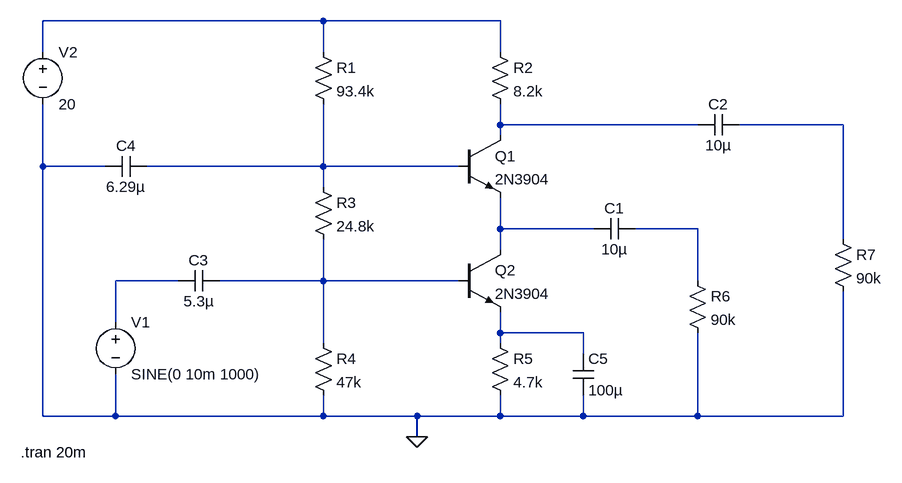
[diagram p0: schematic cascode_amplifier.asc]
cascode_amplifier.asc, the LTspice schematic file:
Version 4
SHEET 1 1124 680
WIRE 256 -16 -176 -16
WIRE 528 -16 256 -16
WIRE -176 32 -176 -16
WIRE 256 32 256 -16
WIRE 528 32 528 -16
WIRE 528 144 528 112
WIRE 832 144 528 144
WIRE 1056 144 896 144
WIRE 528 160 528 144
WIRE -176 208 -176 112
WIRE -80 208 -176 208
WIRE 256 208 256 112
WIRE 256 208 -16 208
WIRE 464 208 256 208
WIRE 256 240 256 208
WIRE 528 304 528 256
WIRE 672 304 528 304
WIRE 832 304 736 304
WIRE 1056 320 1056 144
WIRE 528 336 528 304
WIRE 32 384 -64 384
WIRE 256 384 256 320
WIRE 256 384 96 384
WIRE 464 384 256 384
WIRE 832 384 832 304
WIRE -64 448 -64 384
WIRE 528 464 528 432
WIRE 656 464 528 464
WIRE 256 480 256 384
WIRE 528 480 528 464
WIRE 656 496 656 464
WIRE -176 592 -176 208
WIRE -64 592 -64 528
WIRE -64 592 -176 592
WIRE 256 592 256 560
WIRE 256 592 -64 592
WIRE 400 592 256 592
WIRE 528 592 528 560
WIRE 528 592 400 592
WIRE 656 592 656 560
WIRE 656 592 528 592
WIRE 832 592 832 464
WIRE 832 592 656 592
WIRE 1056 592 1056 400
WIRE 1056 592 832 592
WIRE 400 624 400 592
FLAG 400 624 0
SYMBOL res 240 16 R0
SYMATTR InstName R1
SYMATTR Value 93.4k
SYMBOL res 512 16 R0
SYMATTR InstName R2
SYMATTR Value 8.2k
SYMBOL res 240 224 R0
SYMATTR InstName R3
SYMATTR Value 24.8k
SYMBOL res 240 464 R0
SYMATTR InstName R4
SYMATTR Value 47k
SYMBOL res 512 464 R0
SYMATTR InstName R5
SYMATTR Value 4.7k
SYMBOL res 816 368 R0
SYMATTR InstName R6
SYMATTR Value 90k
SYMBOL res 1040 304 R0
SYMATTR InstName R7
SYMATTR Value 90k
SYMBOL cap 736 288 R90
WINDOW 0 0 32 VBottom 2
WINDOW 3 32 32 VTop 2
SYMATTR InstName C1
SYMATTR Value 10µ
SYMBOL cap 896 128 R90
WINDOW 0 0 32 VBottom 2
WINDOW 3 32 32 VTop 2
SYMATTR InstName C2
SYMATTR Value 10µ
SYMBOL cap 96 368 R90
WINDOW 0 0 32 VBottom 2
WINDOW 3 32 32 VTop 2
SYMATTR InstName C3
SYMATTR Value 5.3µ
SYMBOL voltage -64 432 R0
WINDOW 123 0 0 Left 0
WINDOW 39 0 0 Left 0
SYMATTR InstName V1
SYMATTR Value SINE(0 10m 1000)
SYMBOL voltage -176 16 R0
WINDOW 123 0 0 Left 0
WINDOW 39 0 0 Left 0
SYMATTR InstName V2
SYMATTR Value 20
SYMBOL npn 464 160 R0
SYMATTR InstName Q1
SYMATTR Value 2N3904
SYMBOL npn 464 336 R0
SYMATTR InstName Q2
SYMATTR Value 2N3904
SYMBOL cap -16 192 R90
WINDOW 0 0 32 VBottom 2
WINDOW 3 32 32 VTop 2
SYMATTR InstName C4
SYMATTR Value 6.29µ
SYMBOL cap 640 496 R0
SYMATTR InstName C5
SYMATTR Value 100µ
TEXT -210 648 Left 2 !.tran 20m

The netlist it stands for:
* cascode_amplifier.asc
R1 N001 N004 93.4k
R2 N001 N002 8.2k
R3 N004 N008 24.8k
R4 N008 0 47k
R5 N009 0 4.7k
R6 N006 0 90k
R7 N003 0 90k
C1 N006 N005 10µ
C2 N003 N002 10µ
C3 N008 N007 5.3µ
V1 N007 0 SINE(0 10m 1000)
V2 N001 0 20
Q1 N002 N004 N005 0 2N3904
Q2 N005 N008 N009 0 2N3904
C4 N004 0 6.29µ
C5 N009 0 100µ
.model NPN NPN
.model PNP PNP
.lib standard.bjt
.tran 20m
.backanno
.end